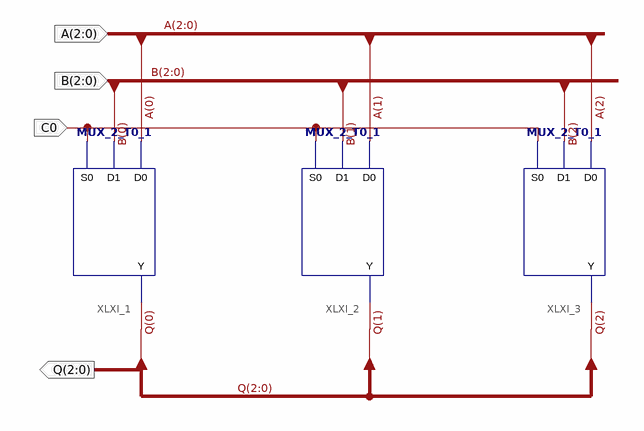
[diagram p0: schematic sheet 1]
// Xilinx ISE schematic MUX_2_3.sch (spartan3e) as structural Verilog: 3 symbols, 4 ports
module MUX_2_3 (
  input  [2:0] A,
  input  [2:0] B,
  input  C0,
  output [2:0] Q
);

  MUX_2_T0_1 XLXI_1 (.D0(A[0]), .D1(B[0]), .S0(C0), .Y(Q[0]));
  MUX_2_T0_1 XLXI_2 (.D0(A[1]), .D1(B[1]), .S0(C0), .Y(Q[1]));
  MUX_2_T0_1 XLXI_3 (.D0(A[2]), .D1(B[2]), .S0(C0), .Y(Q[2]));
endmodule
